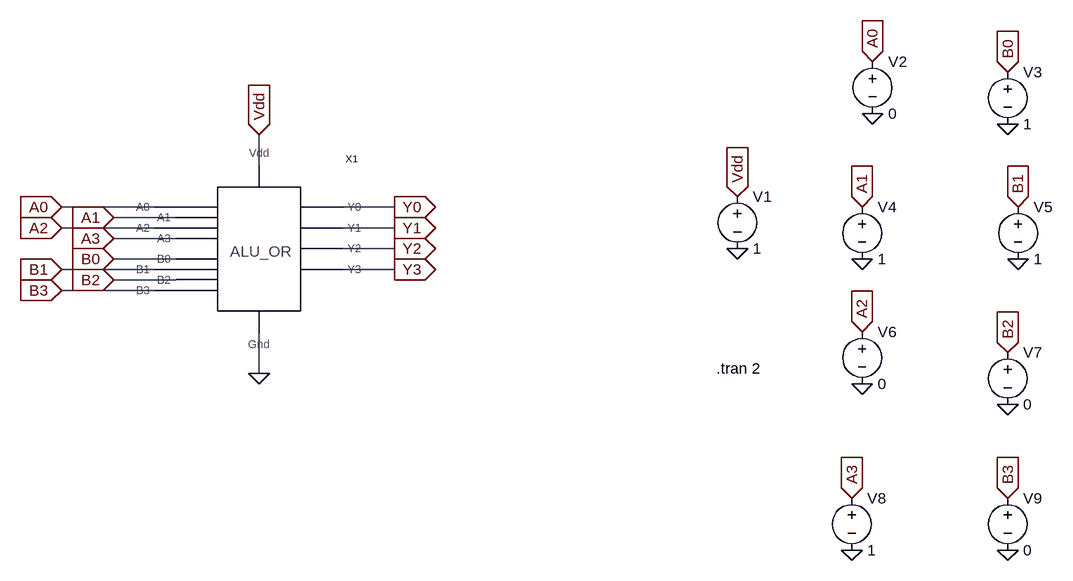
[diagram p0: schematic ALU_OR_Test.asc]
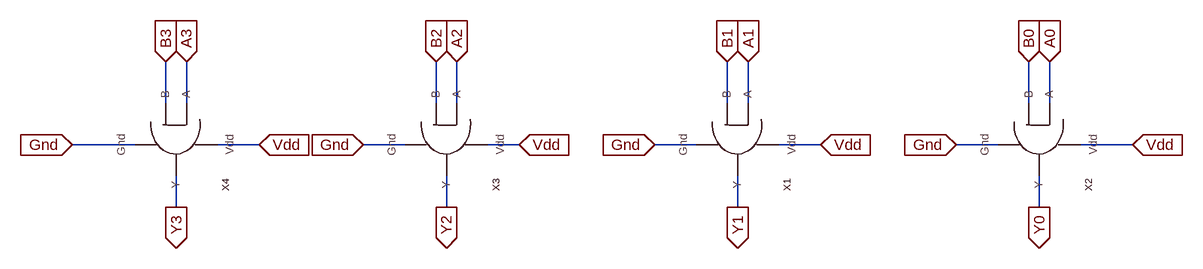
[diagram p1: sub-circuit alu_or.asc]
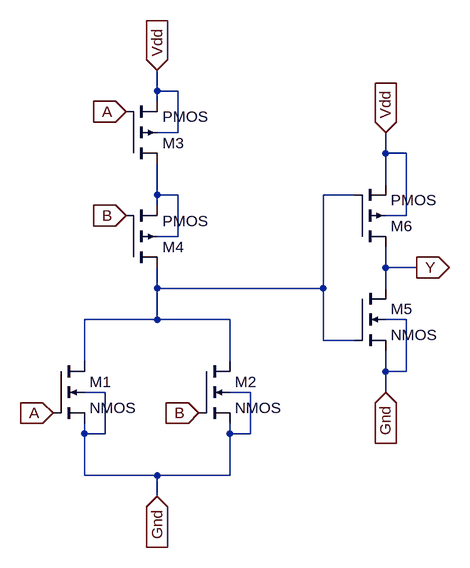
[diagram p2: sub-circuit or.asc]
ALU_OR_Test.asc, the LTspice schematic file:
Version 4
SHEET 1 1304 740
WIRE 64 128 64 80
WIRE -96 192 -240 192
WIRE 272 192 192 192
WIRE -64 208 -160 208
WIRE -96 224 -240 224
WIRE 272 224 192 224
WIRE -64 240 -160 240
WIRE 272 256 192 256
WIRE -64 272 -160 272
WIRE -96 288 -240 288
WIRE 272 288 192 288
WIRE -64 304 -160 304
WIRE -96 320 -240 320
WIRE 64 448 64 384
FLAG 800 176 Vdd
IOPIN 800 176 In
FLAG 1008 -32 A0
IOPIN 1008 -32 In
FLAG 1216 -16 B0
IOPIN 1216 -16 In
FLAG 992 192 A1
IOPIN 992 192 In
FLAG 1232 192 B1
IOPIN 1232 192 In
FLAG 992 384 A2
IOPIN 992 384 In
FLAG 1216 416 B2
IOPIN 1216 416 In
FLAG 976 640 A3
IOPIN 976 640 In
FLAG 1216 640 B3
IOPIN 1216 640 In
FLAG 800 256 0
FLAG 1008 48 0
FLAG 1216 64 0
FLAG 992 272 0
FLAG 1232 272 0
FLAG 992 464 0
FLAG 1216 496 0
FLAG 976 720 0
FLAG 1216 720 0
FLAG 64 80 Vdd
IOPIN 64 80 In
FLAG 64 448 0
FLAG 272 192 Y0
IOPIN 272 192 Out
FLAG 272 224 Y1
IOPIN 272 224 Out
FLAG 272 256 Y2
IOPIN 272 256 Out
FLAG 272 288 Y3
IOPIN 272 288 Out
FLAG -240 192 A0
IOPIN -240 192 In
FLAG -160 208 A1
IOPIN -160 208 In
FLAG -240 224 A2
IOPIN -240 224 In
FLAG -160 240 A3
IOPIN -160 240 In
FLAG -160 272 B0
IOPIN -160 272 In
FLAG -240 288 B1
IOPIN -240 288 In
FLAG -160 304 B2
IOPIN -160 304 In
FLAG -240 320 B3
IOPIN -240 320 In
SYMBOL ALU_OR 80 224 R0
SYMATTR InstName X1
SYMBOL voltage 800 160 R0
WINDOW 123 0 0 Left 0
WINDOW 39 0 0 Left 0
SYMATTR InstName V1
SYMATTR Value 1
SYMBOL voltage 1008 -48 R0
WINDOW 123 0 0 Left 0
WINDOW 39 0 0 Left 0
SYMATTR InstName V2
SYMATTR Value 0
SYMBOL voltage 1216 -32 R0
WINDOW 123 0 0 Left 0
WINDOW 39 0 0 Left 0
SYMATTR InstName V3
SYMATTR Value 1
SYMBOL voltage 992 176 R0
WINDOW 123 0 0 Left 0
WINDOW 39 0 0 Left 0
SYMATTR InstName V4
SYMATTR Value 1
SYMBOL voltage 1232 176 R0
WINDOW 123 0 0 Left 0
WINDOW 39 0 0 Left 0
SYMATTR InstName V5
SYMATTR Value 1
SYMBOL voltage 992 368 R0
WINDOW 123 0 0 Left 0
WINDOW 39 0 0 Left 0
SYMATTR InstName V6
SYMATTR Value 0
SYMBOL voltage 1216 400 R0
WINDOW 123 0 0 Left 0
WINDOW 39 0 0 Left 0
SYMATTR InstName V7
SYMATTR Value 0
SYMBOL voltage 976 624 R0
WINDOW 123 0 0 Left 0
WINDOW 39 0 0 Left 0
SYMATTR InstName V8
SYMATTR Value 1
SYMBOL voltage 1216 624 R0
WINDOW 123 0 0 Left 0
WINDOW 39 0 0 Left 0
SYMATTR InstName V9
SYMATTR Value 0
TEXT 768 440 Left 2 !.tran 2

alu_or.asc, the sub-circuit schematic file:
Version 4
SHEET 1 1160 680
WIRE -432 128 -432 64
WIRE -400 128 -400 64
WIRE -16 128 -16 64
WIRE 16 128 16 64
WIRE 432 128 432 64
WIRE 464 128 464 64
WIRE 896 128 896 64
WIRE 928 128 928 64
WIRE -480 192 -576 192
WIRE -288 192 -352 192
WIRE -64 192 -128 192
WIRE 112 192 64 192
WIRE 384 192 320 192
WIRE 576 192 512 192
WIRE 848 192 784 192
WIRE 1056 192 976 192
WIRE -416 288 -416 240
WIRE 0 288 0 240
WIRE 448 288 448 240
WIRE 912 288 912 240
FLAG -400 64 A3
IOPIN -400 64 In
FLAG -432 64 B3
IOPIN -432 64 In
FLAG -16 64 B2
IOPIN -16 64 In
FLAG 16 64 A2
IOPIN 16 64 In
FLAG 432 64 B1
IOPIN 432 64 In
FLAG 464 64 A1
IOPIN 464 64 In
FLAG 896 64 B0
IOPIN 896 64 In
FLAG 928 64 A0
IOPIN 928 64 In
FLAG 784 192 Gnd
IOPIN 784 192 In
FLAG 320 192 Gnd
IOPIN 320 192 In
FLAG -128 192 Gnd
IOPIN -128 192 In
FLAG -576 192 Gnd
IOPIN -576 192 In
FLAG -416 288 Y3
IOPIN -416 288 Out
FLAG -288 192 Vdd
IOPIN -288 192 In
FLAG 0 288 Y2
IOPIN 0 288 Out
FLAG 112 192 Vdd
IOPIN 112 192 In
FLAG 448 288 Y1
IOPIN 448 288 Out
FLAG 576 192 Vdd
IOPIN 576 192 In
FLAG 912 288 Y0
IOPIN 912 288 Out
FLAG 1056 192 Vdd
IOPIN 1056 192 In
SYMBOL OR 480 192 R90
SYMATTR InstName X1
SYMBOL OR 944 192 R90
SYMATTR InstName X2
SYMBOL OR 32 192 R90
SYMATTR InstName X3
SYMBOL OR -384 192 R90
SYMATTR InstName X4

or.asc, the sub-circuit schematic file:
Version 4
SHEET 1 880 680
WIRE 272 -416 272 -448
WIRE 304 -416 272 -416
WIRE 272 -400 272 -416
WIRE 304 -352 304 -416
WIRE 304 -352 272 -352
WIRE 624 -320 624 -352
WIRE 656 -320 624 -320
WIRE 624 -272 624 -320
WIRE 272 -256 272 -304
WIRE 304 -256 272 -256
WIRE 576 -256 528 -256
WIRE 272 -240 272 -256
WIRE 656 -224 656 -320
WIRE 656 -224 624 -224
WIRE 304 -192 304 -256
WIRE 304 -192 272 -192
WIRE 624 -144 624 -176
WIRE 672 -144 624 -144
WIRE 272 -112 272 -144
WIRE 528 -112 528 -256
WIRE 528 -112 272 -112
WIRE 624 -112 624 -144
WIRE 272 -64 272 -112
WIRE 272 -64 160 -64
WIRE 384 -64 272 -64
WIRE 656 -64 624 -64
WIRE 528 -32 528 -112
WIRE 576 -32 528 -32
WIRE 160 0 160 -64
WIRE 384 0 384 -64
WIRE 624 16 624 -16
WIRE 656 16 656 -64
WIRE 656 16 624 16
WIRE 192 48 160 48
WIRE 416 48 384 48
WIRE 624 48 624 16
WIRE 160 112 160 96
WIRE 192 112 192 48
WIRE 192 112 160 112
WIRE 384 112 384 96
WIRE 416 112 416 48
WIRE 416 112 384 112
WIRE 160 176 160 112
WIRE 272 176 160 176
WIRE 384 176 384 112
WIRE 384 176 272 176
WIRE 272 208 272 176
FLAG 272 -448 Vdd
IOPIN 272 -448 In
FLAG 224 -384 A
IOPIN 224 -384 In
FLAG 112 80 A
IOPIN 112 80 In
FLAG 224 -224 B
IOPIN 224 -224 In
FLAG 336 80 B
IOPIN 336 80 In
FLAG 272 208 Gnd
IOPIN 272 208 In
FLAG 624 -352 Vdd
IOPIN 624 -352 In
FLAG 624 48 Gnd
IOPIN 624 48 In
FLAG 672 -144 Y
IOPIN 672 -144 Out
SYMBOL nmos4 112 0 R0
SYMATTR InstName M1
SYMBOL nmos4 336 0 R0
SYMATTR InstName M2
SYMBOL pmos4 224 -304 M180
SYMATTR InstName M3
SYMBOL pmos4 224 -144 M180
SYMATTR InstName M4
SYMBOL nmos4 576 -112 R0
SYMATTR InstName M5
SYMBOL pmos4 576 -176 M180
SYMATTR InstName M6

The netlist it stands for:
* ALU_OR_Test.asc
XX1 A0 A1 A2 A3 B0 B1 B2 B3 Vdd 0 Y0 Y1 Y2 Y3 alu_or
V1 Vdd 0 1
V2 A0 0 0
V3 B0 0 1
V4 A1 0 1
V5 B1 0 1
V6 A2 0 0
V7 B2 0 0
V8 A3 0 1
V9 B3 0 0

* block symbol definitions
.subckt alu_or A0 A1 A2 A3 B0 B1 B2 B3 Vdd Gnd Y0 Y1 Y2 Y3
XX1 Vdd Y1 Gnd A1 B1 or
XX2 Vdd Y0 Gnd A0 B0 or
XX3 Vdd Y2 Gnd A2 B2 or
XX4 Vdd Y3 Gnd A3 B3 or
.ends alu_or

.subckt or Vdd Y Gnd A B
M1 N002 A Gnd Gnd NMOS
M2 N002 B Gnd Gnd NMOS
M3 N001 A Vdd Vdd PMOS
M4 N002 B N001 N001 PMOS
M5 Y N002 Gnd Gnd NMOS
M6 Y N002 Vdd Vdd PMOS
.ends or

.model NMOS NMOS
.model PMOS PMOS
.lib standard.mos
.tran 2
.backanno
.end